# EAGLE schematic VGA Blinken (EAGLE 7.6.0)
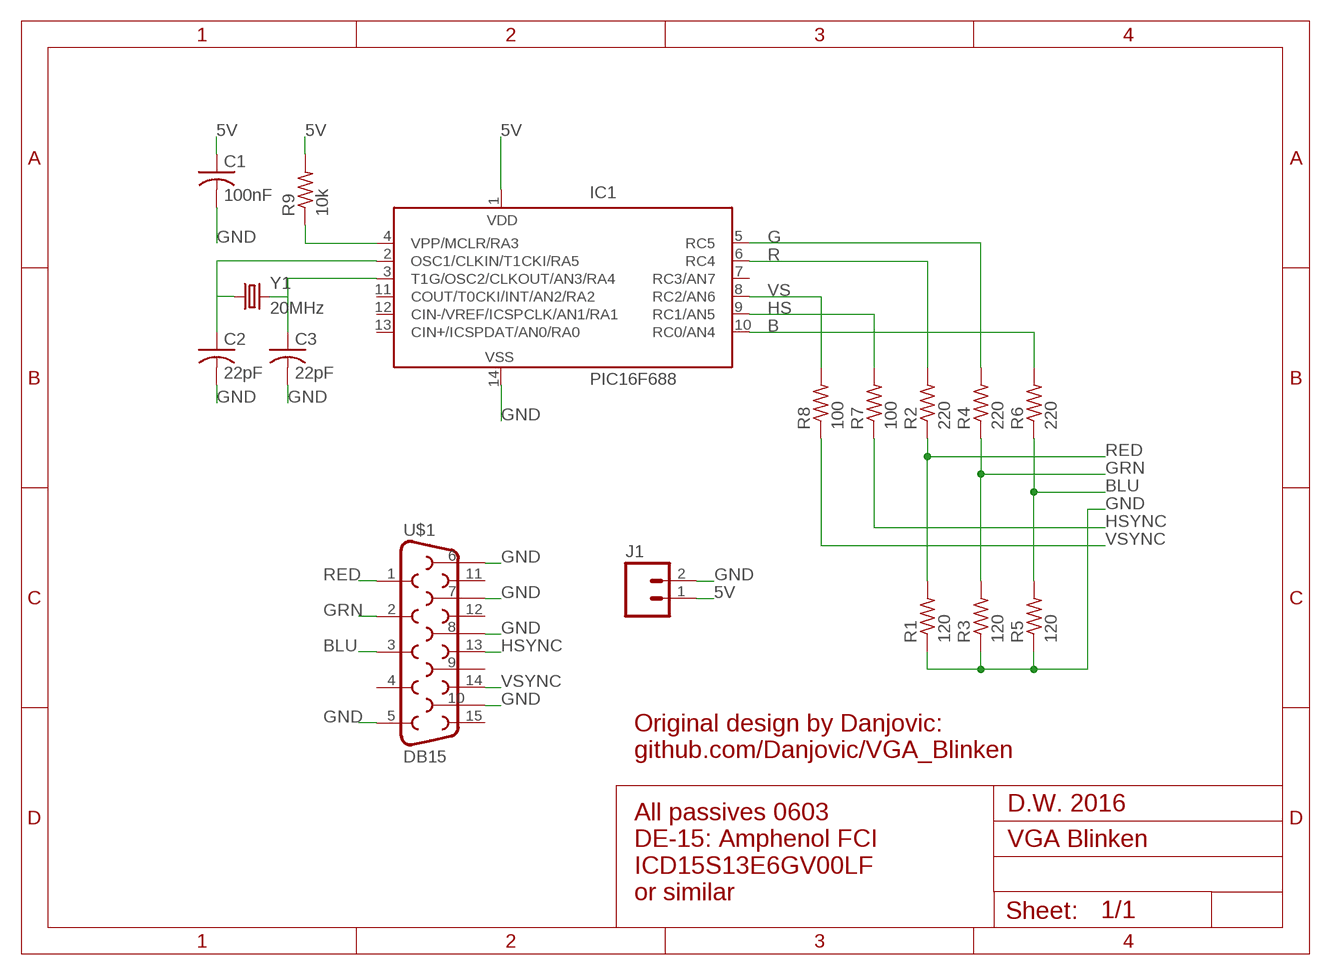
[diagram p0: schematic, sheet 1]

## Parts
C1  100nF  C-USC0603  [C0603]
C2  22pF  C-USC0603  [C0603]
C3  22pF  C-USC0603  [C0603]
IC1  PIC16F688  PIC16F676P  [DIL14]
J1  M02PTH  [1X02]
R1  120  R-US_R0603  [R0603]
R2  220  R-US_R0603  [R0603]
R3  120  R-US_R0603  [R0603]
R4  220  R-US_R0603  [R0603]
R5  120  R-US_R0603  [R0603]
R6  220  R-US_R0603  [R0603]
R7  100  R-US_R0603  [R0603]
R8  100  R-US_R0603  [R0603]
R9  10k  R-US_R0603  [R0603]
U$1  DB15  [DB15]
Y1  20MHz  CRYSTALHC49UV  [HC49U-V]

## Nets
5V: C1.1 IC1.1(VDD) J1.1 R9.2
B: IC1.10(RC0/AN4) R6.2
BLU: R5.2 R6.1 U$1.3
G: IC1.5(RC5) R4.2
GND: C1.2 C2.2 C3.2 IC1.14(VSS) J1.2 R1.1 R3.1 R5.1 U$1.5 U$1.6 U$1.7 U$1.8 U$1.10
GRN: R3.2 R4.1 U$1.2
HS: IC1.9(RC1/AN5) R7.2
HSYNC: R7.1 U$1.13
R: IC1.6(RC4) R2.2
RED: R1.2 R2.1 U$1.1
RST: IC1.4(VPP/MCLR/RA3) R9.1
VS: IC1.8(RC2/AN6) R8.2
VSYNC: R8.1 U$1.14
X1: C2.1 IC1.2(OSC1/CLKIN/T1CKI/RA5) Y1.1
X2: C3.1 IC1.3(T1G/OSC2/CLKOUT/AN3/RA4) Y1.2
Unconnected: IC1.7(RC3/AN7) IC1.11(COUT/T0CKI/INT/AN2/RA2) IC1.12(CIN-/VREF/ICSPCLK/AN1/RA1) IC1.13(CIN+/ICSPDAT/AN0/RA0) U$1.4 U$1.9 U$1.11 U$1.12 U$1.15

## Notes on the sheet
- Original design by Danjovic:
  github.com/Danjovic/VGA_Blinken
- D.W. 2016
- All passives 0603
  DE-15: Amphenol FCI
  ICD15S13E6GV00LF
  or similar

## Library data of the parts
C1-C3 = adafruit:C-US: CAPACITOR, American symbol
IC1 = microchip:PIC16F676: 14-Pin, Flash-Based 8-Bit CMOS Microcontroller High Performance RISC CPU: * Only 35 instructions to learn - All single-cycle instructions except branches * Operating speed: - DC - 20 MHz oscillator/clock input - DC - 200 ns instruction cycle * Internal and external oscillator options - Precision Internal 4 MHz oscillator factory calibrated to ±1% - External Oscillator support for crystals and resonators - 5?s wake-up from SLEEP, 3.0V, typical * Power saving SLEEP mode * Wide operating voltage range - 2.0V to 5.5V * Industrial and Extended temperature range * Low power Power-on Reset (POR) * Power-up Timer (PWRT) and Oscillator Start-up Timer (OST) * Brown-out Detect (BOD) * Watchdog Timer (WDT) with independent oscillator for reliable operation * Multiplexed MCLR/Input-pin * Interrupt-on-pin change * Individual programmable weak pull-ups * Programmable code protection * High Endurance FLASH/EEPROM Cell - 100,000 write FLASH endurance - 1,000,000 write EEPROM endurance - FLASH/Data EEPROM Retention: > 40 years * Standby Current: - 1 nA @ 2.0V, typical * Operating Current: - 8.5?A @ 32 kHz, 2.0V, typical - 100?A @ 1 MHz, 2.0V, typical * Watchdog Timer Current - 300 nA @ 2.0V, typical * Timer1 oscillator current: - 4?A @ 32 kHz, 2.0V, typical * 12 I/O pins with individual direction control * High current sink/source for direct LED drive * Analog-to-Digital Converter module (PIC16F676): - 10-bit resolution - Programmable 8-channel input - Voltage reference input * In-Circuit Serial ProgrammingTM (ICSPTM) via two pins Source: http://ww1.microchip.com/downloads/en/DeviceDoc/40039E.pdf; MF: MICROCHIP; MPN: PIC16F676-I/P; OC_FARNELL: 9760512; OC_NEWARK: 54K2829
J1 = SparkFun-ConnectorsNEW:M02: Standard 2-pin 0.1" header. Use with - straight break away headers ( PRT-00116) - right angle break away headers (PRT-00553) - swiss pins (PRT-00743) - machine pins (PRT-00117) - female headers (PRT-00115) Molex polarized connector foot print use with: PRT-08233 with associated crimp pins and housings. 2.54_SCREWTERM for use with PRT-10571. 3.5mm Screw Terminal footprints for PRT-08084 5mm Screw Terminal footprints for use with PRT-08432
R1-R9 = adafruit:R-US_: RESISTOR, American symbol
U$1 = SparkFun-Connectors:DB15: DB15 / VGA right angle through-hole female connector.
Y1 = SparkFun-FreqCtrl:CRYSTAL: Various standard crystals. Proven footprints.